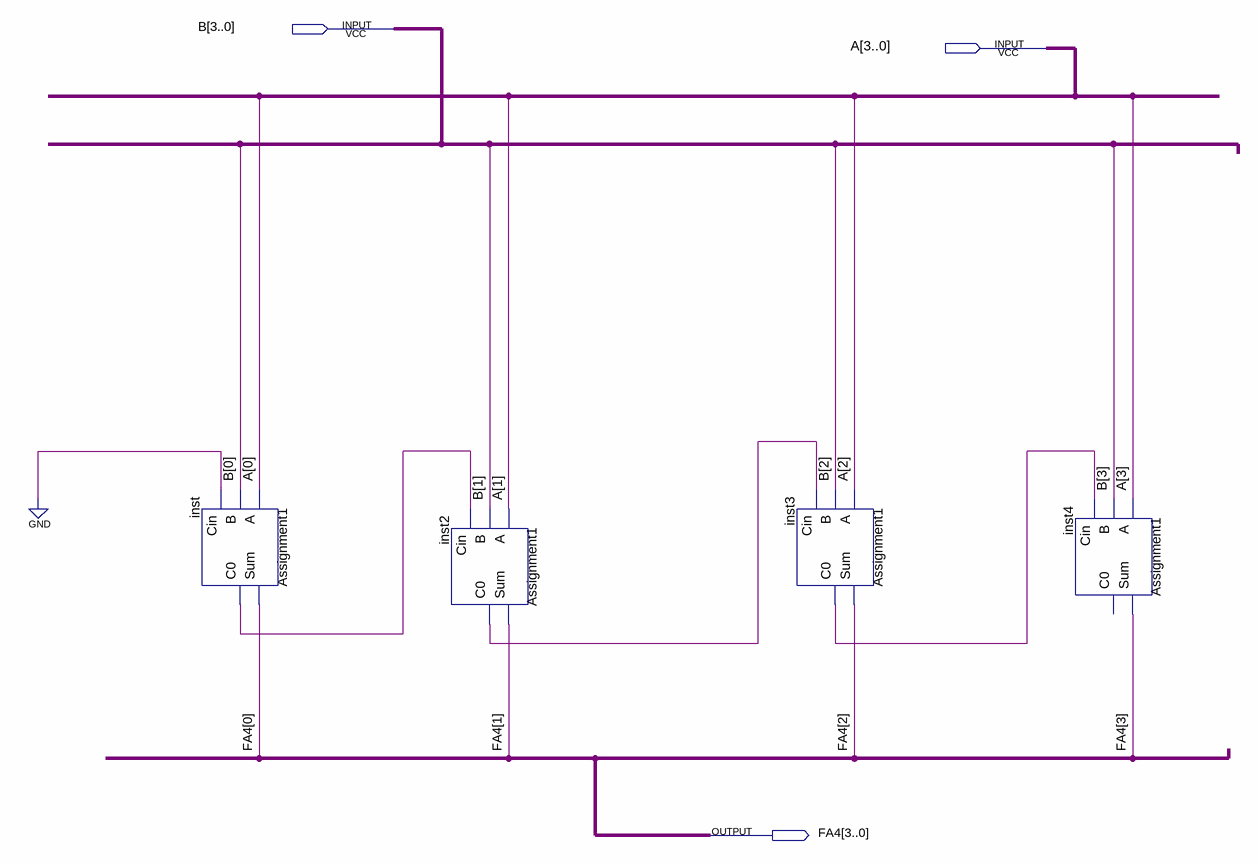
[diagram p0: schematic sheet]
// Quartus schematic FA.bdf as structural Verilog: 4 symbols, 3 pins
module FA (
  input  [3:0] B,
  input  [3:0] A,
  output [3:0] FA4
);

  wire inst2_c0, inst3_c0, inst_c0;

  Assignment1 inst (.A(A[0]), .B(B[0]), .Cin(1'b0), .Sum(FA4[0]), .C0(inst_c0));
  Assignment1 inst2 (.A(A[1]), .B(B[1]), .Cin(inst_c0), .Sum(FA4[1]), .C0(inst2_c0));
  Assignment1 inst3 (.A(A[2]), .B(B[2]), .Cin(inst2_c0), .Sum(FA4[2]), .C0(inst3_c0));
  Assignment1 inst4 (.A(A[3]), .B(B[3]), .Cin(inst3_c0), .Sum(FA4[3]));  // open: C0
endmodule
